# Altium schematic sheet Sensors.SchDoc
size A; SheetNumber: 5; SheetTotal: 9
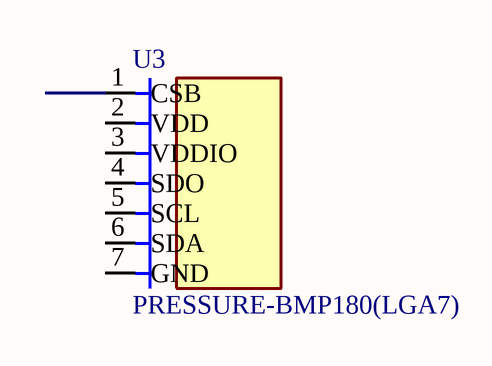
[diagram p0: Sensors.SchDoc]

## Parts
U3  PRESSURE-BMP180(LGA7)  [LGA7-1.5-3.8X3.6MM]

## Nets

Not connected (* = marked no-connect by the designer): U3 1(CSB) 2(VDD) 3(VDDIO) 4(SDO) 5(SCL) 6(SDA) 7(GND)

## Library data of the parts
U3 = PRESSURE-BMP180(LGA7): Pressure Sensor 4.35PSI ~ 15.95PSI (30kPa ~ 110kPa) Absolute - 16 ~ 19 b 7-VLGA; MF: Bosch; MP: BMP180; SnapEDA_Link: https://www.snapeda.com/parts/BMP180/Bosch/view-part/?ref=snap; Package: LGA-7 Bosch; Value: *; Check_prices: https://www.snapeda.com/parts/BMP180/Bosch/view-part/?ref=eda